# Altium schematic sheet Sheet2.SchDoc: Zasilacz DC
size A4; Author: Jakub Zajączkowski; Address1: 3-26V; Revision: 1; ProjectName: Zasilacz
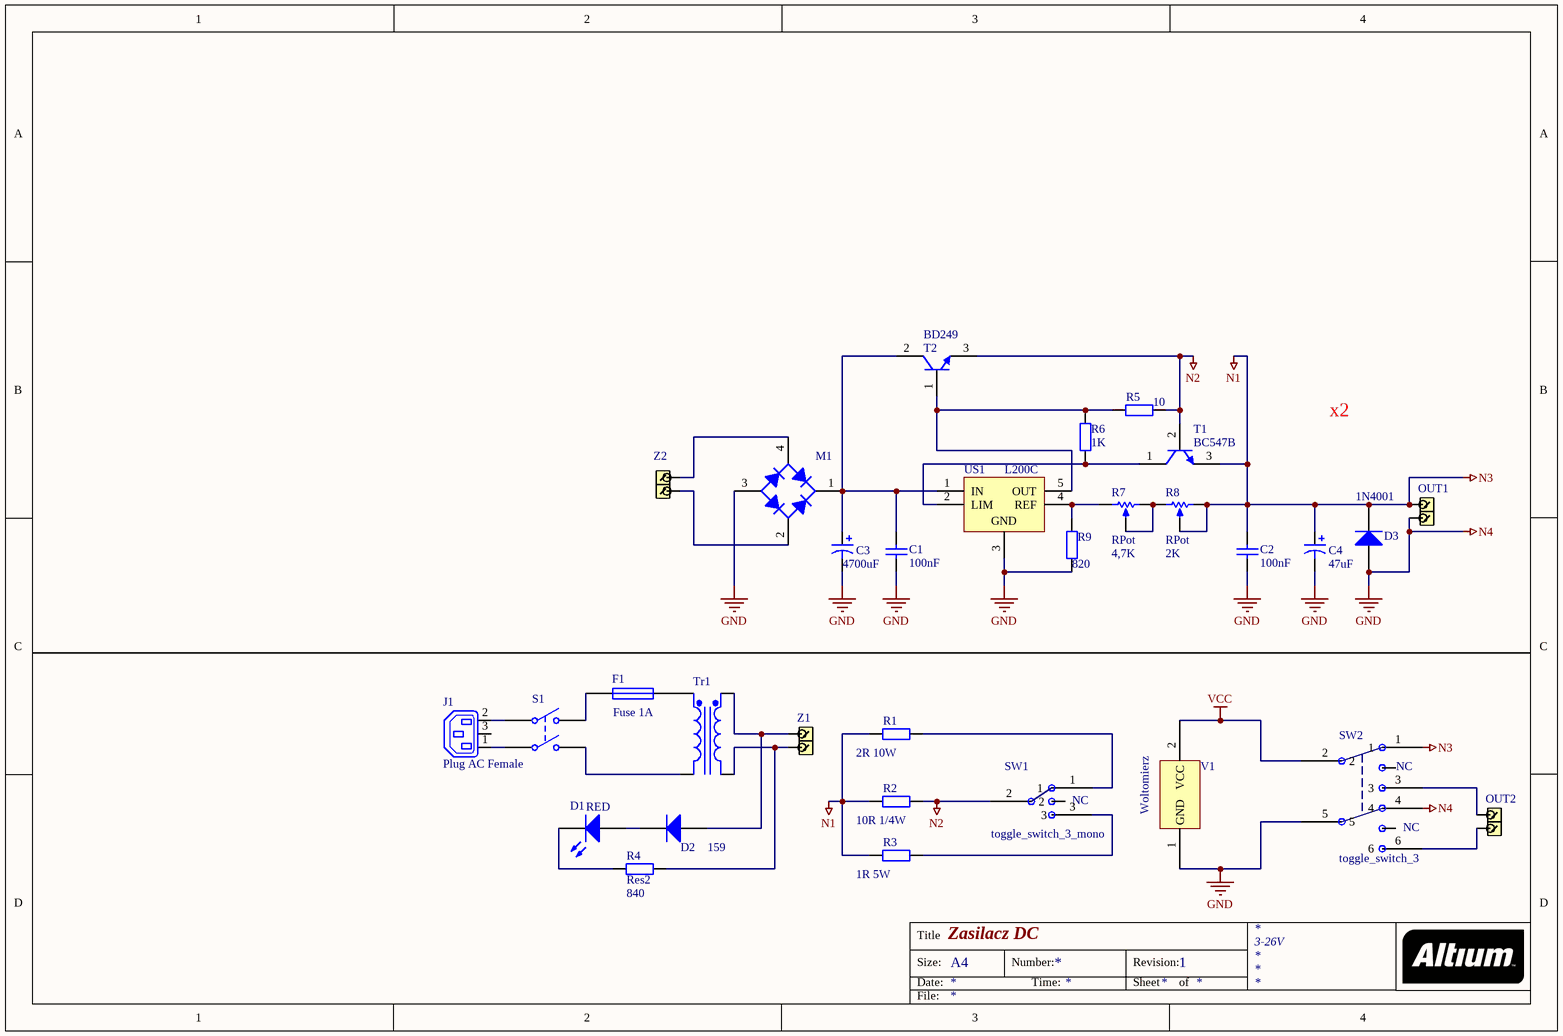
[diagram p0: Sheet2.SchDoc]

## Parts
C1  value 100nF  [CAPR2.54-5.1x2.5]  (hidden comment: Cap Semi)
C2  value 100nF  [CAPR2.54-5.1x2.5]  (hidden comment: Cap Semi)
C3  value 4700uF  [CAPPR7.5-16x20]  (hidden comment: Cap Pol1)
C4  value 47uF  [CAPPR5-6.3x15]  (hidden comment: Cap Pol1)
D1  RED  [LED-0]
D2  159  [SMC]
D3  1N4001  [DO-41]
F1  Fuse 1A  [PIN-W2/E2.8]
J1  Plug AC Female  [IEC7-2H3]
M1  Bridge1  [D-38]  (value not drawn)
OUT1  ARK  [ARK2]  (value not drawn)
OUT2  ARK  [ARK2]  (value not drawn)
R1  value 2R 10W  [AXIAL-0.4]  (hidden comment: Res2)
R2  value 10R 1/4W  [AXIAL-0.4]  (hidden comment: Res2)
R3  value 1R 5W  [AXIAL-0.4]  (hidden comment: Res2)
R4  Res2  value 840  [AXIAL-0.4]
R5  value 10  [AXIAL-0.4]  (hidden comment: Res2)
R6  value 1K  [AXIAL-0.4]  (hidden comment: Res2)
R7  RPot  value 4,7K  [VR5]
R8  RPot  value 2K  [VR5]
R9  value 820  [AXIAL-0.4]  (hidden comment: Res2)
S1  SW-DPST  [DPST-4]  (value not drawn)
SW1  toggle_switch_3_mono
SW2  toggle_switch_3
T1  BC547B  [ONSC-TO-92-3-29-11]
T2  BD249  [ONSC-TO-220-3-221A-09]
Tr1  Trans Cupl  [TRF_4]  (value not drawn)
US1  L200C  [PentawattV]
V1  Woltomierz
Z1  (no value)  [ARK2]
Z2  (no value)  [ARK2]

## Nets
GND: C1.1 C2.1 C3.2 C4.2 D3.1(A) M1.3(A) OUT1.1 R9.1 SW2.4 SW2.5 US1.3(GND) V1.1(GND)  [also labelled N4]
N1: C2.2 C4.1 D3.2(K) OUT1.2 R1.1 R2.1 R3.1 R8.2(BOT) R8.3(TAP) SW2.1 T1.3(E)  [also labelled N3]
N2: R2.2 R5.2 SW1.2 T1.2(B) T2.3(E)
VCC: SW2.2 V1.2(VCC)
NetC1_2: C1.2 C3.1 M1.1(K) T2.2(C) US1.1(IN)
NetD1_1: D1.1(A) D2.2(K)
NetD1_2: D1.2(K) R4.1
NetD2_1: D2.1(A) Tr1.3(Sec+) Z1.2
NetF1_1: F1.1 S1.2(NO1)
NetF1_2: F1.2 Tr1.1(Pri+)
NetJ1_1: J1.1(L) S1.3(COMMON2)
NetJ1_2: J1.2(N) S1.1(COMMON1)
NetM1_2: M1.2(C) Z2.2
NetM1_4: M1.4(C) Z2.1
NetOUT2_1: OUT2.1 SW2.6
NetOUT2_2: OUT2.2 SW2.3
NetR1_2: R1.2 SW1.1
NetR3_2: R3.2 SW1.3
NetR4_2: R4.2 Tr1.4(Sec-) Z1.1
NetR5_1: R5.1 R6.1 T2.1(B) US1.5(OUT)
NetR6_2: R6.2 T1.1(C) US1.2(LIM)
NetR7_1: R7.1(TOP) R9.2 US1.4(REF)
NetR7_2: R7.2(BOT) R7.3(TAP) R8.1(TOP)
NetS1_4: S1.4(NO2) Tr1.2(Pri-)

Not connected (* = marked no-connect by the designer): J1 3(E)

## Notes on the sheet
- x2
- Title
- Size:
- Date:
- A4
- Number:
- Time:
- Revision:
- Sheet
- of
- File:
- (in symbol toggle_switch_3) NC
- (in symbol toggle_switch_3_mono) NC

## Library data of the parts
C1 C2 = Cap Semi: Capacitor (Semiconductor SIM Model); Published: 8-Jun-2000; LatestRevisionDate: 29-May-2009; LatestRevisionNote: IPC-7351 Footprint Added.; PackageReference: C1206; Publisher: Altium Limited; PackageDescription: Chip Capacitor
C3 C4 = Cap Pol1: Polarized Capacitor (Radial); Published: 8-Jun-2000; LatestRevisionDate: 17-Jul-2002; LatestRevisionNote: Re-released for DXP Platform.; PackageReference: RB7.6-15; Publisher: Altium Limited; PackageDescription: Polarized Capacitor (Radial); 2 Leads
D1 = LED0: Typical INFRARED GaAs LED; Published: 8-Jun-2000; LatestRevisionDate: 08-Jul-2005; LatestRevisionNote: Mech Layer 1 removed.; PackageReference: LED-0; Publisher: Altium Limited; PackageDescription: LED; 2 Leads
D2 = Diode: Default Diode; Published: 8-Jun-2000; LatestRevisionDate: 17-Jul-2002; LatestRevisionNote: Re-released for DXP Platform.; PackageVersion: Sep-1996; PackageReference: SMC; Publisher: Altium Limited; PackageDescription: DO-214-AB/SMC; 2 C-Bend Leads; Body 7.9 x 5.9 mm, inc. leads (LxW); Code_JEDEC: DO-214-AB
D3 = Diode 1N4001: 1 Amp General Purpose Rectifier; Published: 8-Jun-2000; LatestRevisionDate: 17-Jul-2002; LatestRevisionNote: Re-released for DXP Platform.; DatasheetVersion: 1998; PackageVersion: Aug-1999; PackageReference: DO-41; Publisher: Altium Limited; PackageDescription: Diode, Axial; Body 5.2 x 2.7 mm (LxDia. max), Lead Dia. 0.86 mm (max); Code_JEDEC: DO-204-AL; ComponentLink1Description: Manufacturer Link; ComponentLink1URL: http://www.fairchildsemi.com/; ComponentLink2Description: Datasheet; ComponentLink2URL: http://www.fairchildsemi.com/ds/1N%2F1N4001.pdf
F1 = Fuse 1: Fuse; Published: 8-Jun-2000; LatestRevisionDate: 17-Jul-2002; LatestRevisionNote: Re-released for DXP Platform.; PackageReference: PIN-W2/E2.8; Publisher: Altium Limited; PackageDescription: Thru-Hole; 2 Leads
J1 = Plug AC Female: IEC Mains Power Outlet, EN60 320-2-2 F Class I, PC Flange Rear Mount, Chassis Socket; PackageDocument: ver.80, 15-Sep-2003; MaximumRating: 10A, 250V a.c. (UL & CSA 15A, 250V a.c.); MountingFixtures: Not drawn on schematic symbol.; PCB_Layout: Complies with manufacturer's recommendation.; DrillSize: Corresponds to nominal value.; Published: 15-Jul-2004; LatestRevisionDate: 15-Jul-2004; LatestRevisionNote: Component Replaced & renamed from "Phonejack".; DatasheetDocument: ver.80, 15-Sep-2003; PackageReference: PX0675/PC; Publisher: Altium Limited; Terminations: P.C. Spills; ComponentLink1Description: Manufacturer Link; ComponentLink1URL: http://www.bulgin.co.uk/
M1 = Bridge1: Full Wave Diode Bridge; Published: 8-Jun-2000; LatestRevisionDate: 29-May-2009; LatestRevisionNote: Sch pins A & K swapped.; DatasheetVersion: E2732B; PackageReference: D-38; Publisher: Altium Limited; PackageDescription: Bridge Rectifier; 4 Terminals; Body 9.4 x 9.4 mm (typ); Pitch 5.08 mm
R1-R6 R9 = Res2: Resistor; Published: 8-Jun-2000; LatestRevisionDate: 17-Jul-2002; LatestRevisionNote: Re-released for DXP Platform.; PackageReference: AXIAL-0.4; Publisher: Altium Limited; PackageDescription: Axial Device, Thru-Hole; 2 Leads; 0.4 in Pin Spacing
R7 R8 = RPot: Potentiometer; Sim Note: Enter the Resistance value and the set point into parameter fields.; Set Position: 0.5; Published: 8-Jun-2000; LatestRevisionDate: 17-Jul-2002; LatestRevisionNote: Re-released for DXP Platform.; PackageReference: VR5; Publisher: Altium Limited; PackageDescription: Variable Resistor, Thru-Hole; 3 Leads
S1 = SW-DPST: Double-Pole, Single-Throw Switch; Published: 24-Mar-1999; LatestRevisionDate: 17-Jul-2002; LatestRevisionNote: Re-released for DXP Platform.; PackageReference: DPST-4; Publisher: Altium Limited; PackageDescription: Switch; 4 Leads
SW1 = toggle_switch_3_mono: Single 3-stage toggle switch
SW2 = toggle_switch_3: Dual 3-stage toggle switch
T1 = BC547B: Amplifier Transistor, NPN Silicon, 3-Pin TO-92, Bulk Box; Manufacturer: On Semiconductor; fT Min (MHz): 150; IC Continuous (A): 0.1; DatasheetVersion: Rev. 7; PackageVersion: Rev. AM; PackageReference: TO-92-3-29-11_AM_SL; PackageDescription: 3-Pin Transistor Outline, Body 4.825 x 3.685 mm, Pitch 1.27 mm; Supplier 1: Digi-Key; Supplier Part Number 1: BC547BOS-ND; Packing: Bulk Box; Polarity: NPN; RoHS: FALSE; Mounting Technology: Through Hole; PartNumber: BC547B; ComponentLink1Description: Manufacturer URL; ComponentLink1URL: http://www.onsemi.com/; ComponentLink2Description: Datasheet; ComponentLink2URL: http://www.onsemi.com/pub_link/Collateral/BC546-D.PDF; ComponentLink3Description: Package Specification; ComponentLink3URL: http://www.onsemi.cn/pub_link/Collateral/2N6426-D.PDF
T2 = BUV27: NPN Silicon Power Transistor, 3-Pin TO-220, Tube; Manufacturer: On Semiconductor; Note: 0; IC Continuous (A): 12; DatasheetVersion: Rev. 3; PackageVersion: Rev. AG, 09/2011; PackageReference: TO-220-3-221A-09; PackageDescription: 3-Pin Flange Mount, Vertical Straight Lead, Body 9.97 x 4.445 mm, Pitch 2.54 mm; Packing: Tube; Polarity: NPN; RoHS: FALSE; Mounting Technology: Through Hole; PartNumber: BUV27; ComponentLink1Description: Manufacturer URL; ComponentLink1URL: http://www.onsemi.com/; ComponentLink2Description: Datasheet; ComponentLink2URL: http://www.onsemi.com/pub_link/Collateral/BUV27-D.PDF; ComponentLink3Description: Package Specification; ComponentLink3URL: http://www.onsemi.com/pub_link/Collateral/221A-09.PDF
Tr1 = Trans Cupl: Transformer (Coupled Inductor Model); Published: 8-Jun-2000; LatestRevisionDate: 17-Jul-2002; LatestRevisionNote: Re-released for DXP Platform.; PackageReference: TRF_4; Publisher: Altium Limited; PackageDescription: Transformer; 4 Leads
US1 = L200CV: Adjustable Voltage and Current Regulator, 5-Pin Pentawatt, Tube; DatasheetVersion: Jan-2000; PackageVersion: Feb-2004; PackageReference: PentawattV; PackageDescription: TO, Thru-Hole, Vertical, Heatsink Mounted; 5 Bent Staggered Leads; Pitch 1.7 mm; PartNumber: L200CV; ComponentLink1Description: Manufacturer URL; ComponentLink1URL: http://www.st.com; ComponentLink2Description: Datasheet; ComponentLink2URL: http://www.st.com/internet/com/TECHNICAL_RESOURCES/TECHNICAL_LITERATURE/DATASHEET/CD00000053.pdf; ComponentLink3Description: Package Specification; ComponentLink3URL: http://www.st.com/internet/com/TECHNICAL_RESOURCES/TECHNICAL_LITERATURE/PACKAGE_INFORMATION/CD00004635.pdf
Z1 Z2 = ARK